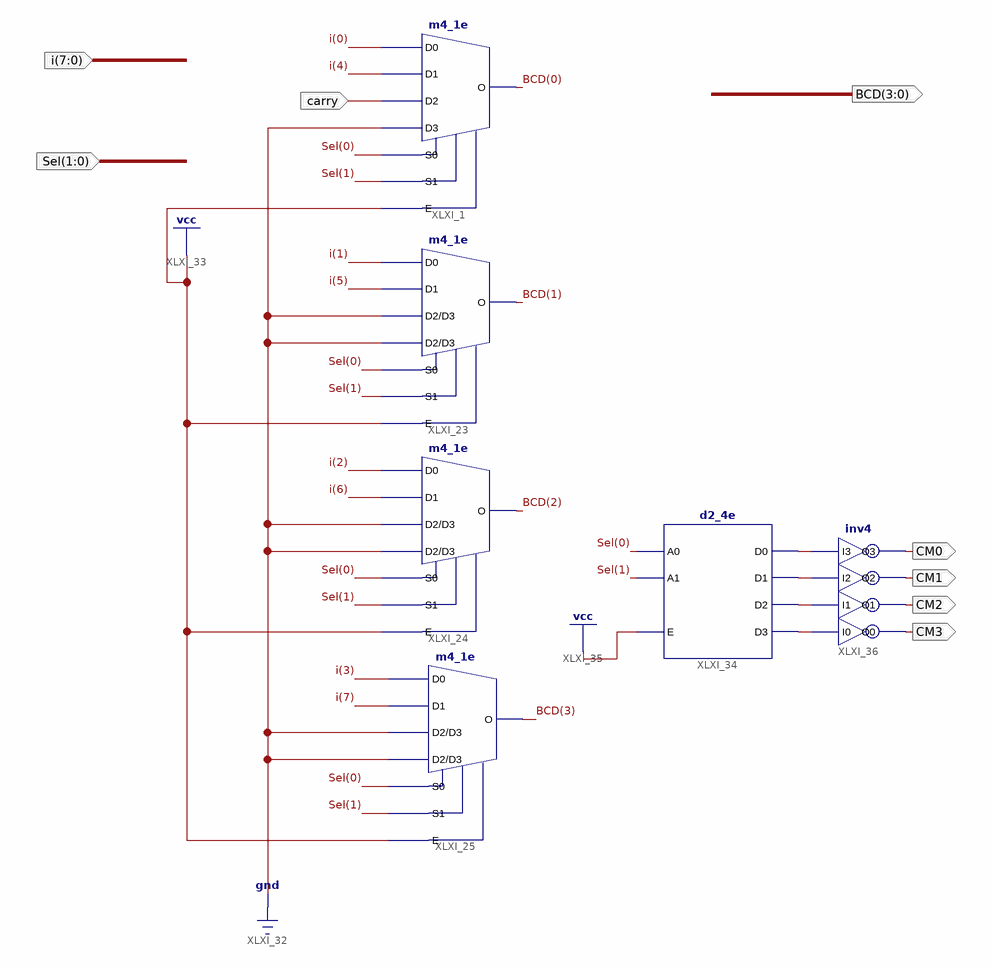
[diagram p0: schematic sheet 1]
// Xilinx ISE schematic rreal_selector.sch (spartan6) as structural Verilog: 6 symbols, 8 ports
module rreal_selector (
  input  carry,
  input  [7:0] i,
  input  [1:0] Sel,
  output [3:0] BCD,
  output CM3,
  output CM2,
  output CM1,
  output CM0
);

  wire XLXN_125, XLXN_126, XLXN_127, XLXN_128;

  m4_1e XLXI_23 (.D0(i[1]), .D1(i[5]), .D2(1'b0), .D3(1'b0), .E(1'b1), .S0(Sel[0]), .S1(Sel[1]), .O(BCD[1]));
  m4_1e XLXI_24 (.D0(i[2]), .D1(i[6]), .D2(1'b0), .D3(1'b0), .E(1'b1), .S0(Sel[0]), .S1(Sel[1]), .O(BCD[2]));
  m4_1e XLXI_25 (.D0(i[3]), .D1(i[7]), .D2(1'b0), .D3(1'b0), .E(1'b1), .S0(Sel[0]), .S1(Sel[1]), .O(BCD[3]));
  m4_1e XLXI_1 (.D0(i[0]), .D1(i[4]), .D2(carry), .D3(1'b0), .E(1'b1), .S0(Sel[0]), .S1(Sel[1]), .O(BCD[0]));
  inv4 XLXI_36 (.I0(XLXN_128), .I1(XLXN_127), .I2(XLXN_126), .I3(XLXN_125), .O0(CM3), .O1(CM2), .O2(CM1), .O3(CM0));
  d2_4e XLXI_34 (.A0(Sel[0]), .A1(Sel[1]), .E(1'b1), .D0(XLXN_125), .D1(XLXN_126), .D2(XLXN_127), .D3(XLXN_128));
endmodule
